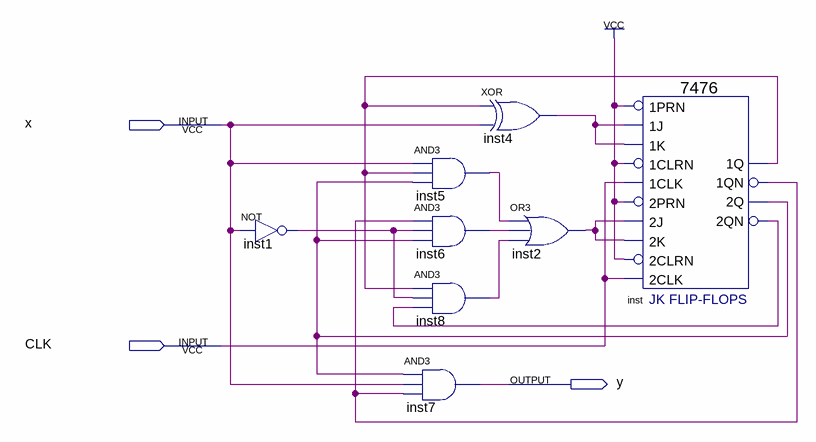
[diagram p0: schematic sheet]
// Quartus schematic 101.bdf as structural Verilog: 8 symbols, 3 pins
module \101  (
  input  x,
  input  CLK,
  output y
);

  wire inst1_out, inst2_out, inst4_out, inst5_out, inst6_out, inst8_out, inst_1q, inst_1qn, inst_2q, inst_2qn;

  not inst1 (inst1_out, x);
  and inst5 (inst5_out, x, inst_1q, inst_2q);
  and inst6 (inst6_out, inst_1qn, inst1_out, inst_2q);
  and inst8 (inst8_out, inst_1q, inst1_out, inst_2qn);
  and inst7 (y, inst_2q, x, inst_1qn);
  xor inst4 (inst4_out, inst_1q, x);
  or inst2 (inst2_out, inst5_out, inst6_out, inst8_out);
  \7476  inst (
    .\1J (inst4_out), .\1K (inst4_out), .\1PRN (1'b1), .\2PRN (1'b1), .\2J (inst2_out), .\1CLK (CLK),
    .\1CLRN (1'b1), .\2K (inst2_out), .\2CLRN (1'b1), .\2CLK (CLK), .\2QN (inst_2qn), .\1Q (inst_1q),
    .\2Q (inst_2q), .\1QN (inst_1qn));
endmodule
